# Altium schematic sheet comm.SchDoc
size A
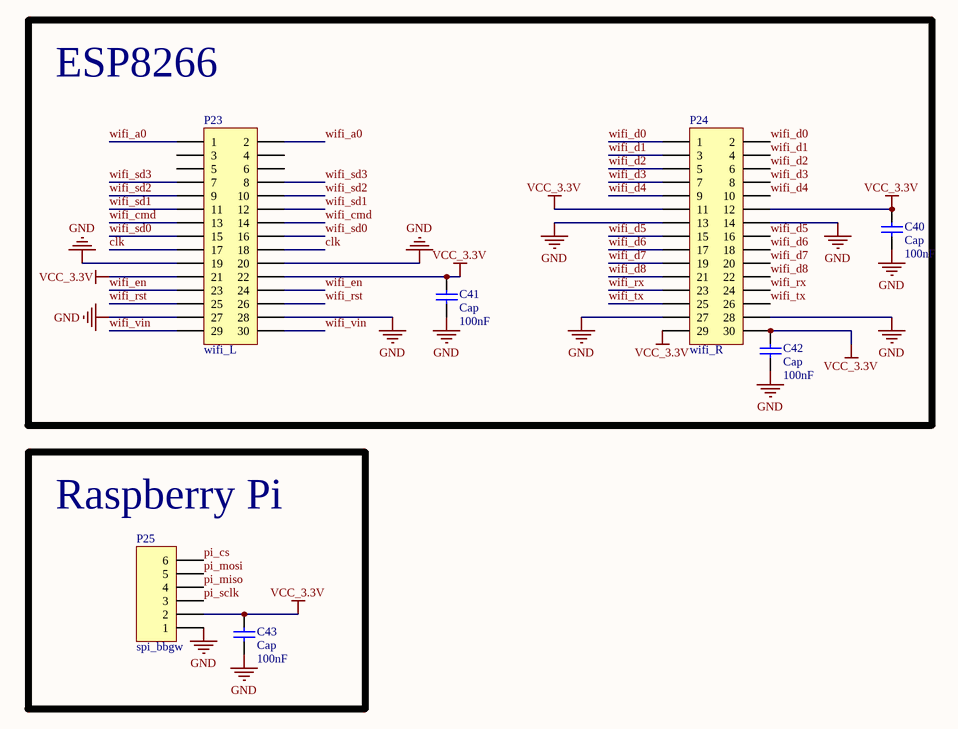
[diagram p0: comm.SchDoc]

## Parts
C40  Cap  value 100nF  [RAD-0.1]
C41  Cap  value 100nF  [RAD-0.1]
C42  Cap  value 100nF  [RAD-0.1]
C43  Cap  value 100nF  [RAD-0.1]
P23  wifi_L  [HDR2X15]
P24  wifi_R  [HDR2X15]
P25  spi_bbgw  [HDR1X6]

## Blocks framed on the sheet
ESP8266: C40-C42 P23 P24
Raspberry Pi: C43 P25

## Nets
GND: C40.1 C41.1 C42.1 C43.1 P23.19 P23.20 P23.27 P23.28 P24.13 P24.14 P24.27 P24.28 P25.1
VCC_3.3V: C40.2 C41.2 C42.2 C43.2 P23.21 P23.22 P24.11 P24.12 P24.29 P24.30 P25.2
clk: P23.17 P23.18
pi_cs: P25.6
pi_miso: P25.4
pi_mosi: P25.5
pi_sclk: P25.3
wifi_a0: P23.1 P23.2
wifi_cmd: P23.13 P23.14
wifi_d0: P24.1 P24.2
wifi_d1: P24.3 P24.4
wifi_d2: P24.5 P24.6
wifi_d3: P24.7 P24.8
wifi_d4: P24.9 P24.10
wifi_d5: P24.15 P24.16
wifi_d6: P24.17 P24.18
wifi_d7: P24.19 P24.20
wifi_d8: P24.21 P24.22
wifi_en: P23.23 P23.24
wifi_rst: P23.25 P23.26
wifi_rx: P24.23 P24.24
wifi_sd0: P23.15 P23.16
wifi_sd1: P23.11 P23.12
wifi_sd2: P23.9 P23.10
wifi_sd3: P23.7 P23.8
wifi_tx: P24.25 P24.26
wifi_vin: P23.29 P23.30

Not connected (* = marked no-connect by the designer): P23 3 4 5 6

## Library data of the parts
C40-C43 = Cap: Capacitor; Published: 8-Jun-2000; LatestRevisionDate: 17-Jul-2002; LatestRevisionNote: Re-released for DXP Platform.; PackageReference: RAD-0.3; Publisher: Altium Limited; PackageDescription: Radial Cap, Thru-Hole; 2 Leads; 0.3 in Pin Spacing
P23 P24 = Header 15X2: Header, 15-Pin, Dual row; LatestRevisionDate: 17-Jul-2002; LatestRevisionNote: Re-released for DXP Platform.; Publisher: Altium Limited
P25 = Header 6: Header, 6-Pin; LatestRevisionDate: 17-Jul-2002; LatestRevisionNote: Re-released for DXP Platform.; Publisher: Altium Limited